# EAGLE design mega_board (EAGLE 6.2)
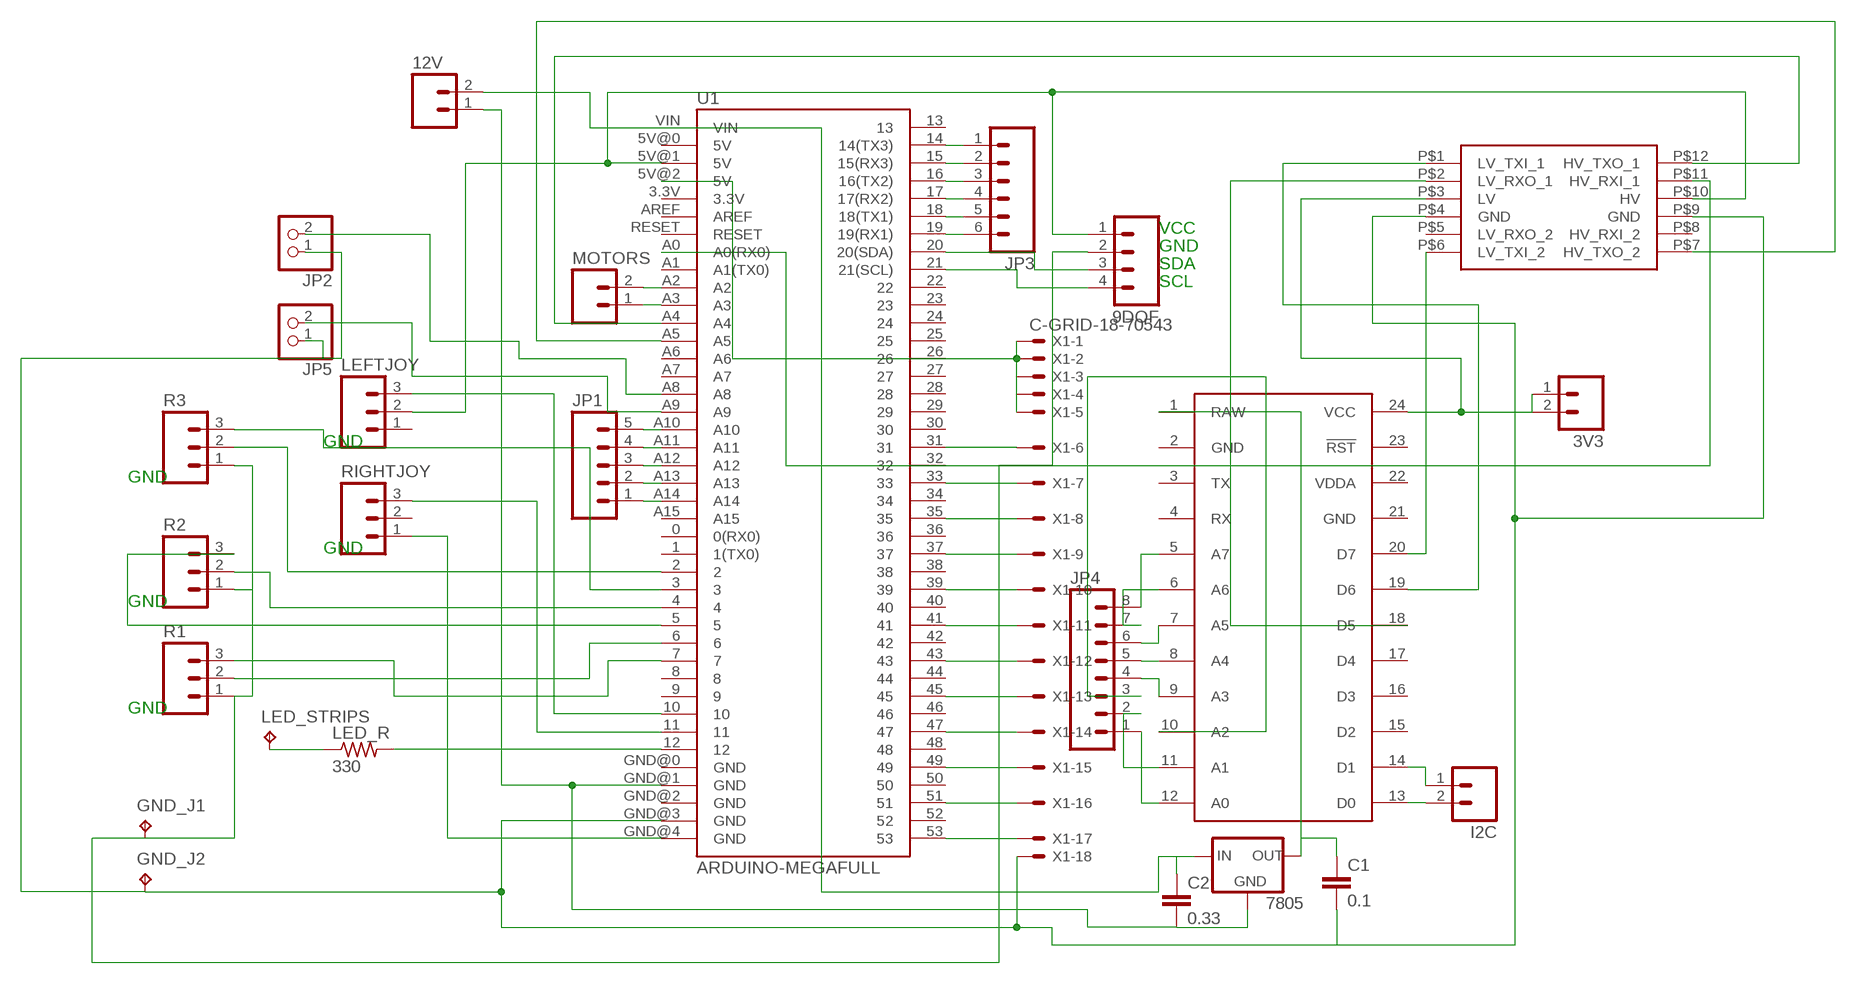
[diagram p0: schematic, sheet 1]

## Parts
3V3  M02PTH3  [1X02_LONGPADS]
9DOF  M04LONGPADS  [1X04_LONGPADS]
12V  M02PTH3  [1X02_LONGPADS]
7805  V_REG_78XXSIDE  [78XXL]
C1  0.1  C-EU050-024X044  [C050-024X044]
C2  0.33  C-EU050-024X044  [C050-024X044]
GND_J1  TPPAD1-17  [P1-17]
GND_J2  TPPAD1-17  [P1-17]
I2C  M02PTH3  [1X02_LONGPADS]
JP1  M05PTH_LONGPADS  [1X05_LONGPADS]
JP2  PINHD-1X2  [1X02]
JP3  M06LONGPADS  [1X06_LONGPADS]
JP4  M08LONGPADS  [1X08_LONGPADS]
JP5  PINHD-1X2  [1X02]
LED_R  330  R-US_0207/10  [0207/10]
LED_STRIPS  TPPAD1-17  [P1-17]
LEFTJOY  M03LONGPADS  [1X03_LONGPADS]
MOTORS  M02PTH3  [1X02_LONGPADS]
R1  M03LONGPADS  [1X03_LONGPADS]
R2  M03LONGPADS  [1X03_LONGPADS]
R3  M03LONGPADS  [1X03_LONGPADS]
RIGHTJOY  M03LONGPADS  [1X03_LONGPADS]
U1  ARDUINO-MEGAFULL  [ARDUINO_MEGA]
U$1  SPARK_CORECORE  [SPARK_CORE]
U$2  LOGIC_LEVEL_CONVERTER  [LOGIC_LEVEL_CONVERTER]
X1  C-GRID-18-70543  [70543-18]

## Nets
5V: 9DOF.1 LEFTJOY.2 U1.5V@1(5V) U$2.P$10(HV)
GND: C1.2 GND_J2.TP JP2.1 JP5.1 U1.GND@3(GND) U$2.P$4(GND) U$2.P$9(GND) X1.18
N$1: 9DOF.4 U1.21(21(SCL))
N$2: 9DOF.3 U1.20(20(SDA))
N$3: 3V3.1 3V3.2 U$1.24(VCC) U$2.P$3(LV)
N$4: RIGHTJOY.3 U1.11
N$5: U1.A4 U$2.P$12(HV_TXO_1)
N$6: U1.A5 U$2.P$7(HV_TXO_2)
N$7: U$1.20(D7) U$2.P$6(LV_TXI_2)
N$8: U$1.19(D6) U$2.P$1(LV_TXI_1)
N$9: LEFTJOY.3 U1.10
N$10: JP3.1 U1.14(14(TX3))
N$11: JP3.2 U1.15(15(RX3))
N$12: JP3.3 U1.16(16(TX2))
N$13: JP3.4 U1.17(17(RX2))
N$14: JP3.5 U1.18(18(TX1))
N$15: JP3.6 U1.19(19(RX1))
N$16: JP2.2 U1.A8
N$17: JP5.2 U1.A9
N$18: JP1.5 U1.A10
N$19: JP1.4 U1.A11
N$20: JP1.3 U1.A12
N$21: JP1.2 U1.A13
N$22: JP1.1 U1.A14
N$23: 12V.2 7805.IN C2.1 U1.VIN
N$24: 12V.1 7805.GND C2.2 U1.GND@1(GND)
N$25: JP4.8 U$1.5(A7)
N$26: JP4.7 U$1.6(A6)
N$27: JP4.6 U$1.7(A5)
N$28: JP4.5 U$1.8(A4)
N$29: JP4.4 U$1.9(A3)
N$30: JP4.1 U$1.12(A0)
N$31: JP4.2 U$1.11(A1)
N$32: JP4.3 U$1.10(A2)
N$33: I2C.2 U$1.13(D0)
N$34: I2C.1 U$1.14(D1)
N$35: 7805.OUT C1.1 U$1.1(RAW)
N$36: RIGHTJOY.1 U1.GND@4(GND)
N$37: MOTORS.2 U1.A2
N$38: MOTORS.1 U1.A3
N$39: LED_R.2 U1.12
N$40: LED_R.1 LED_STRIPS.TP
N$41: R3.3 U1.3
N$42: 9DOF.2 GND_J1.TP R1.1 R2.1 R3.1
N$43: R3.2 U1.2
N$44: R2.2 U1.4
N$45: R2.3 U1.5
N$46: R1.2 U1.6
N$47: R1.3 U1.7
N$48: U$1.18(D5) U$2.P$2(LV_RXO_1)
N$49: U1.A0(A0(RX0)) U$2.P$11(HV_RXI_1)
N$50: U1.51 X1.16
N$51: U1.53 X1.17
N$52: U1.31 X1.6
N$53: U1.47 X1.14
N$54: U1.33 X1.7
N$55: U1.35 X1.8
N$56: U1.37 X1.9
N$57: U1.39 X1.10
N$58: U1.41 X1.11
N$59: U1.43 X1.12
N$60: U1.45 X1.13
N$61: U1.49 X1.15
N$62: U1.5V@2(5V) X1.1 X1.2 X1.3 X1.4 X1.5
Unconnected: LEFTJOY.1 RIGHTJOY.2 U1.0(0(RX0)) U1.1(1(TX0)) U1.3.3V U1.5V@0(5V) U1.8 U1.9 U1.13 U1.22 U1.23 U1.24 U1.25 U1.26 U1.27 U1.28 U1.29 U1.30 U1.32 U1.34 U1.36 U1.38 U1.40 U1.42 U1.44 U1.46 U1.48 U1.50 U1.52 U1.A1(A1(TX0)) U1.A6 U1.A7 U1.A15 U1.AREF U1.GND@0(GND) U1.GND@2(GND) U1.RESET U$1.3(TX) U$1.4(RX) U$1.15(D2) U$1.16(D3) U$1.17(D4) U$1.23(!RST) U$2.P$5(LV_RXO_2) U$2.P$8(HV_RXI_2)

## Notes on the sheet
- VCC
- GND
- SDA
- SCL
- GND
- GND
- GND
- GND
- GND

## Power pins joined to a net without a drawn wire
GND: U$1.2(GND) U$1.21(GND)
VDDA: U$1.22(VDDA)

## Library data of the parts
3V3 12V I2C MOTORS = SparkFun:M02: Header 2 Standard 2-pin 0.1" header. Use with straight break away headers (SKU : PRT-00116), right angle break away headers (PRT-00553), swiss pins (PRT-00743), machine pins (PRT-00117), and female headers (PRT-00115). Molex polarized connector foot print use with SKU : PRT-08233 with associated crimp pins and housings.
9DOF = SparkFun:M04: Header 4 Standard 4-pin 0.1" header. Use with straight break away headers (SKU : PRT-00116), right angle break away headers (PRT-00553), swiss pins (PRT-00743), machine pins (PRT-00117), and female headers (PRT-00115). Molex polarized connector foot print use with SKU : PRT-08231 with associated crimp pins and housings.
7805 = SparkFun:V_REG_78XX: Voltage Regulator Standard 7805 5V regulator. IGO (Input Ground Output). Spark Fun Electronics SKU : COM-00107
C1 C2 = rcl:C-EU: CAPACITOR, European symbol
GND_J1 GND_J2 LED_STRIPS = testpad:TP: Test pad
JP1 = SparkFun:M05: Header 5 Standard 5-pin 0.1" header. Use with straight break away headers (SKU : PRT-00116), right angle break away headers (PRT-00553), swiss pins (PRT-00743), machine pins (PRT-00117), and female headers (PRT-00115). Molex polarized connector foot print use with SKU : PRT-08230 with associated crimp pins and housings.
JP2 JP5 = pinhead:PINHD-1X2: PIN HEADER
JP3 = SparkFun:M06: Header 6 Standard 6-pin 0.1" header. Use with straight break away headers (SKU : PRT-00116), right angle break away headers (PRT-00553), swiss pins (PRT-00743), machine pins (PRT-00117), and female headers (PRT-00115). Molex polarized connector foot print use with SKU : PRT-08094 with associated crimp pins and housings. NOTES ON THE VARIANTS LOCK and LOCK_LONGPADS... This footprint was designed to help hold the alignment of a through-hole component (i.e. 6-pin header) while soldering it into place. You may notice that each hole has been shifted either up or down by 0.005 of an inch from it's more standard position (which is a perfectly straight line). This slight alteration caused the pins (the squares in the middle) to touch the edges of the holes. Because they are alternating, it causes a "brace" to hold the component in place. 0.005 has proven to be the perfect amount of "off-center" position when using our standard breakaway headers. Although looks a little odd when you look at the bare footprint, once you have a header in there, the alteration is very hard to notice. Also, if you push a header all the way into place, it is covered up entirely on the bottom side. This idea of altering the position of holes to aid alignment will be further integrated into the Sparkfun Library for other footprints. It can help hold any component with 3 or more connection pins.
JP4 = SparkFun:M08: Header 8 Standard 8-pin 0.1" header. Use with straight break away headers (SKU : PRT-00116), right angle break away headers (PRT-00553), swiss pins (PRT-00743), machine pins (PRT-00117), and female headers (PRT-00115).
LED_R = resistor:R-US_: RESISTOR, American symbol
LEFTJOY R1-R3 RIGHTJOY = SparkFun:M03: Header 3 Standard 3-pin 0.1" header. Use with straight break away headers (SKU : PRT-00116), right angle break away headers (PRT-00553), swiss pins (PRT-00743), machine pins (PRT-00117), and female headers (PRT-00115). Molex polarized connector foot print use with SKU : PRT-08232 with associated crimp pins and housings.
U1 = SparkFun-Boards:ARDUINO-MEGA: Arduino Mega board footprint
U$1 = Spark:SPARK_CORE
U$2 = SparkFun-Boards:LOGIC_LEVEL_CONVERTER: Logic Level Converter (3.3v - 5v) https://www.sparkfun.com/products/8745
X1 = con-molex:C-GRID-18: CONNECTOR wire to board 2.54 mm (0.100") pitch header; OC_FARNELL: unknown; OC_NEWARK: unknown

## Board
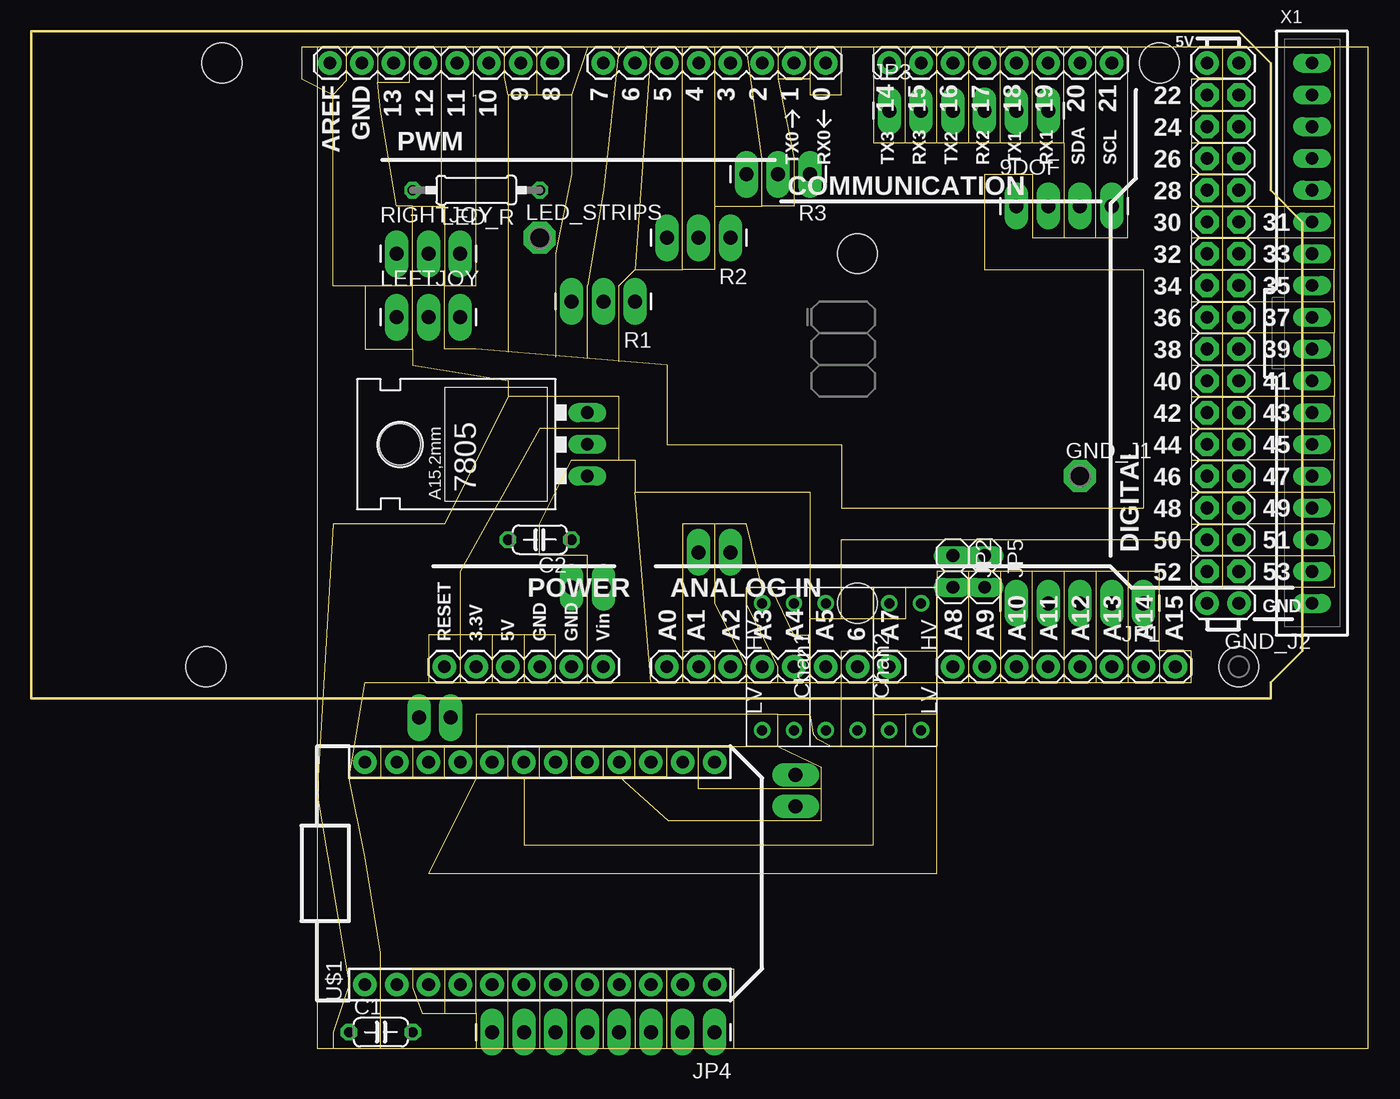
[diagram p1: board, top side]
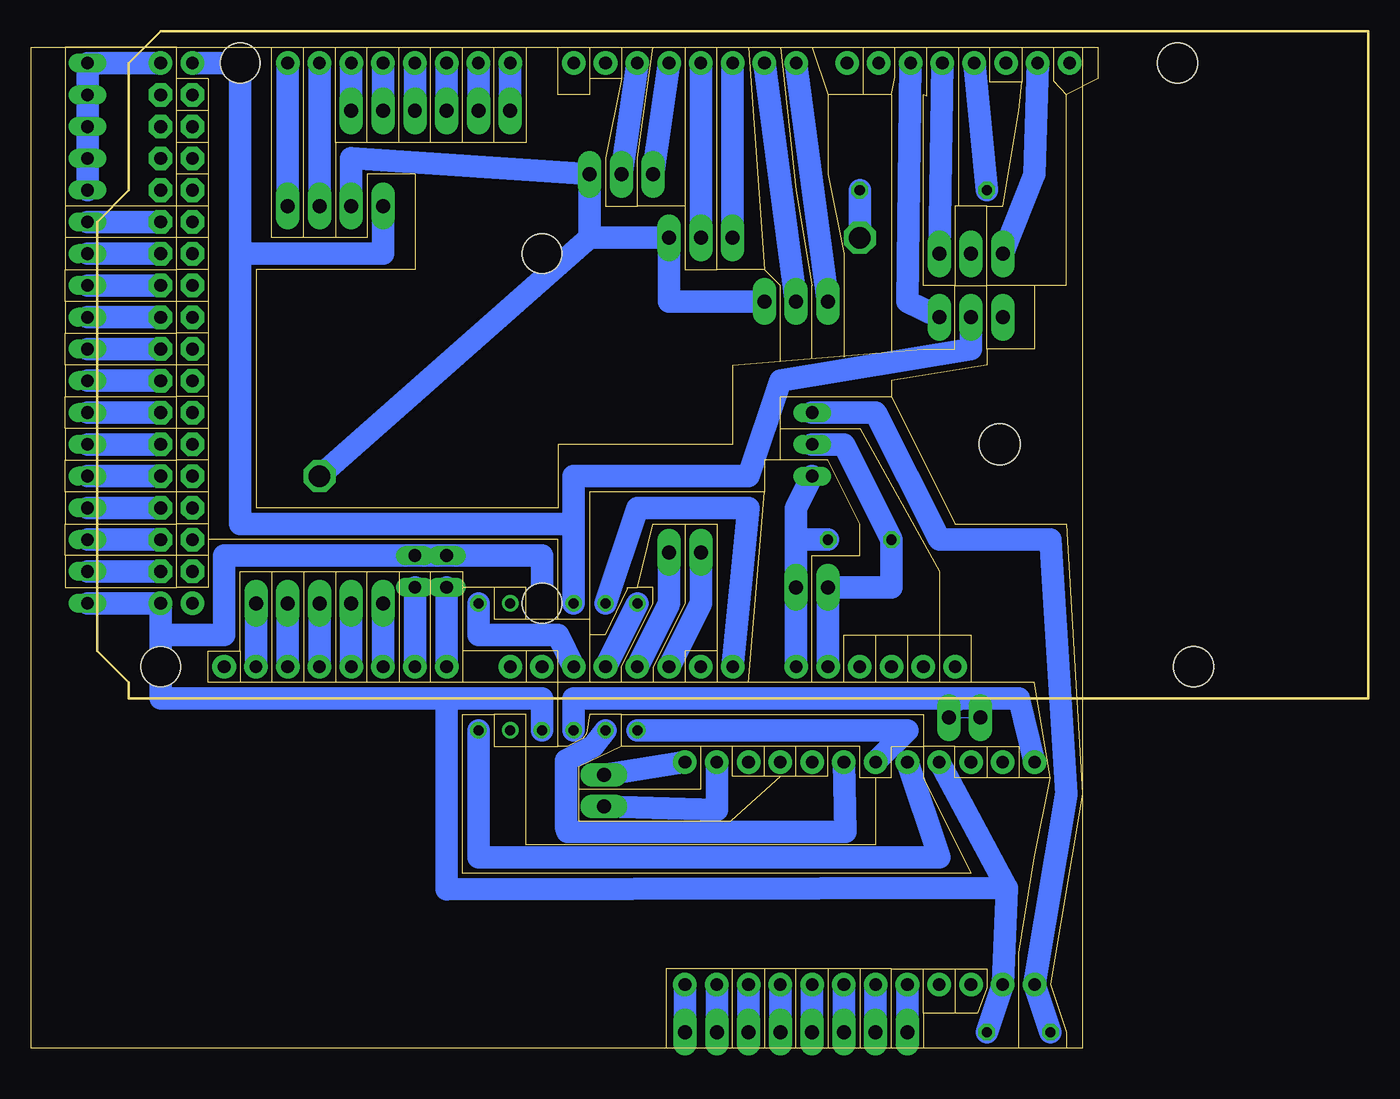
[diagram p2: board, bottom side, seen from below]

Size 84 x 80 mm. Coordinates in mm from the lower left corner, seen from the top.
Outline: 0,0 84,0 84,80 0,80 0,0
Copper layers (1*16): Top 0.035mm / dielectric 1.5mm / Bottom 0.035mm
Design rules: minimum track width 10mil, minimum drill 24mil, track to track 8mil, track to pad 8mil, pad to pad 8mil, via to via 8mil, smd to smd 8mil, copper to edge 40mil, drill to drill 8mil, minimum pad ring 10mil, minimum via ring 8mil, stop-mask expansion 4mil, vias tented up to drill 0mil, thermal gap 10mil
Milling: 394 lines

### Footprints (pad centres in the part's own frame; a part is rotated, then mirrored left to right if it is on the bottom)
1X02_LONGPADS = drill 1.118 pad 1.88 long: 1 0,0; 2 2.54,0
1X04_LONGPADS = drill 1.118 pad 1.88 long: 1 0,0; 2 2.54,0; 3 5.08,0; 4 7.62,0
78XXL = drill 1.016 long: GND 0,-3.81; IN -2.54,-3.81; OUT 2.54,-3.81 | hole 3.302: 0,11.176
C050-024X044 = drill 0.813 octagon: 1 -2.54,0; 2 2.54,0
P1-17 = drill 1.702 pad 2.54 octagon: TP 0,0
1X05_LONGPADS = drill 1.118 pad 1.88 long: 1 0,0; 2 2.54,0; 3 5.08,0; 4 7.62,0; 5 10.16,0
1X02 = drill 1.016 long: 1 -1.27,0; 2 1.27,0
1X06_LONGPADS = drill 1.118 pad 1.88 long: 1 0,0; 2 2.54,0; 3 5.08,0; 4 7.62,0; 5 10.16,0; 6 12.7,0
1X08_LONGPADS = drill 1.118 pad 1.88 long: 1 0,0; 2 2.54,0; 3 5.08,0; 4 7.62,0; 5 10.16,0; 6 12.7,0; 7 15.24,0; 8 17.78,0
0207/10 = drill 0.813 octagon: 1 -5.08,0; 2 5.08,0
1X03_LONGPADS = drill 1.118 pad 1.88 long: 1 0,0; 2 2.54,0; 3 5.08,0
ARDUINO_MEGA = drill 1.016 pad 1.88: 0 63.5,50.8; 1 60.96,50.8; 2 58.42,50.8; 3 55.88,50.8; 3.3V 35.56,2.54; 4 53.34,50.8; 5 50.8,50.8; 5V@0 38.1,2.54; 5V@1 93.98,50.8; 5V@2 96.52,50.8; 6 48.26,50.8; 7 45.72,50.8; 8 41.656,50.8; 9 39.116,50.8; 10 36.576,50.8; 11 34.036,50.8; 12 31.496,50.8; 13 28.956,50.8; 14 68.58,50.8; 15 71.12,50.8; 16 73.66,50.8; 17 76.2,50.8; 18 78.74,50.8; 19 81.28,50.8; 20 83.82,50.8; 21 86.36,50.8; A0 50.8,2.54; A1 53.34,2.54; A2 55.88,2.54; A3 58.42,2.54; A4 60.96,2.54; A5 63.5,2.54; A6 66.04,2.54; A7 68.58,2.54; A8 73.66,2.54; A9 76.2,2.54; A10 78.74,2.54; A11 81.28,2.54; A12 83.82,2.54; A13 86.36,2.54; A14 88.9,2.54; A15 91.44,2.54; AREF 23.876,50.8; GND@0 40.64,2.54; GND@1 43.18,2.54; GND@2 93.98,7.62; GND@3 96.52,7.62; GND@4 26.416,50.8; RESET 33.02,2.54; VIN 45.72,2.54 | drill 1.016 pad 1.88 octagon: 22 93.98,48.26; 23 96.52,48.26; 24 93.98,45.72; 25 96.52,45.72; 26 93.98,43.18; 27 96.52,43.18; 28 93.98,40.64; 29 96.52,40.64; 30 93.98,38.1; 31 96.52,38.1; 32 93.98,35.56; 33 96.52,35.56; 34 93.98,33.02; 35 96.52,33.02; 36 93.98,30.48; 37 96.52,30.48; 38 93.98,27.94; 39 96.52,27.94; 40 93.98,25.4; 41 96.52,25.4; 42 93.98,22.86; 43 96.52,22.86; 44 93.98,20.32; 45 96.52,20.32; 46 93.98,17.78; 47 96.52,17.78; 48 93.98,15.24; 49 96.52,15.24; 50 93.98,12.7; 51 96.52,12.7; 52 93.98,10.16; 53 96.52,10.16 | hole 3.2: 15.24,50.8; 13.97,2.54; 66.04,35.56; 66.04,7.62; 90.17,50.8; 96.52,2.54
SPARK_CORE = drill 1.016 pad 1.88: 1 -8.89,13.97; 2 -8.89,11.43; 3 -8.89,8.89; 4 -8.89,6.35; 5 -8.89,3.81; 6 -8.89,1.27; 7 -8.89,-1.27; 8 -8.89,-3.81; 9 -8.89,-6.35; 10 -8.89,-8.89; 11 -8.89,-11.43; 12 -8.89,-13.97; 13 8.89,-13.97; 14 8.89,-11.43; 15 8.89,-8.89; 16 8.89,-6.35; 17 8.89,-3.81; 18 8.89,-1.27; 19 8.89,1.27; 20 8.89,3.81; 21 8.89,6.35; 22 8.89,8.89; 23 8.89,11.43; 24 8.89,13.97
LOGIC_LEVEL_CONVERTER = drill 0.8: P$1 1.27,13.97; P$2 1.27,11.43; P$3 1.27,8.89; P$4 1.27,6.35; P$5 1.27,3.81; P$6 1.27,1.27; P$7 11.43,1.27; P$8 11.43,3.81; P$9 11.43,6.35; P$10 11.43,8.89; P$11 11.43,11.43; P$12 11.43,13.97
70543-18 = drill 1.016 long: 1 -21.59,0; 2 -19.05,0; 3 -16.51,0; 4 -13.97,0; 5 -11.43,0; 6 -8.89,0; 7 -6.35,0; 8 -3.81,0; 9 -1.27,0; 10 1.27,0; 11 3.81,0; 12 6.35,0; 13 8.89,0; 14 11.43,0; 15 13.97,0; 16 16.51,0; 17 19.05,0; 18 21.59,0

### Placement (x,y rotation side)
3V3  8.13,26.42 0 top
9DOF  55.88,67.31 0 top
12V  20.32,36.83 0 top
7805  17.78,48.26 90 top
C1  5.08,1.27 0 top
C2  17.78,40.64 180 top
GND_J1  60.96,45.72 0 top
GND_J2  73.66,30.48 0 top
I2C  38.23,19.3 90 top
JP1  66.04,35.56 180 top
JP2  50.8,38.1 270 top
JP3  45.72,74.93 0 top
JP4  31.75,1.27 180 top
JP5  53.34,38.1 270 top
LED_R  12.7,68.58 180 top
LED_STRIPS  17.78,64.77 0 top
LEFTJOY  6.35,58.42 0 top
MOTORS  33.02,39.62 180 top
R1  25.4,59.69 180 top
R2  33.02,64.77 180 top
R3  39.37,69.85 180 top
RIGHTJOY  6.35,63.5 0 top
U1  -22.86,27.94 0 top
U$1  17.78,13.97 90 top
U$2  49.53,24.13 90 top
X1  79.5,57.15 270 top

### Tracks (layer width: path | path; a pad name or v marks a point on that pad's centre or on a via)
5V
  Bottom 1.778: U1.5V@1 67.31,78.74 67.31,63.5 | 67.31,63.5 55.88,63.5 9DOF.1 | U$2.P$10 40.64,41.91 | 40.64,41.91 67.31,41.91 67.31,63.5 | LEFTJOY.2 8.89,55.88 24.13,53.34 26.67,45.72 40.64,45.72 40.64,41.91
GND
  Bottom 1.778: U$1.21 6.01,12.8 | 6.01,12.8 U$1.2 C1.2 | U$2.P$4 43.18,27.94 50.8,27.94 | 50.8,27.94 50.8,12.7 6.01,12.8 | 73.66,33.02 U1.GND@3 X1.18 | 73.66,33.02 GND_J2.TP 73.66,27.94 50.8,27.94 | U$2.P$9 43.18,39.37 JP2.1 JP5.1 68.58,39.37 68.58,33.02 73.66,33.02
N$1
  Bottom 1.778: U1.21 9DOF.4
N$2
  Bottom 1.778: 9DOF.3 U1.20
N$3
  Bottom 0.01: 3V3.1 3V3.2 8.13,27.94
  Bottom 1.778: U$1.24 5.08,27.94 8.13,27.94 40.64,27.94 U$2.P$3
N$4
  Bottom 1.778: U1.11 RIGHTJOY.3
N$5
  Bottom 1.778: U$2.P$12 U1.A4
N$6
  Bottom 1.778: U1.A5 41.91,33.02 48.26,33.02 U$2.P$7
N$7
  Bottom 1.778: U$1.20 11.43,15.24 48.26,15.24 U$2.P$6
N$8
  Bottom 1.778: U$2.P$1 13.97,25.4 U$1.19
N$9
  Bottom 1.778: U1.10 13.97,59.69 LEFTJOY.3
N$10
  Bottom 1.778: JP3.1 U1.14
N$11
  Bottom 1.778: JP3.2 U1.15
N$12
  Bottom 1.778: JP3.3 U1.16
N$13
  Bottom 1.778: JP3.4 U1.17
N$14
  Bottom 1.778: JP3.5 U1.18
N$15
  Bottom 1.778: JP3.6 U1.19
N$16
  Bottom 1.778: JP2.2 U1.A8
N$17
  Bottom 1.778: JP5.2 U1.A9
N$18
  Bottom 1.778: U1.A10 JP1.5
N$19
  Bottom 1.778: U1.A11 JP1.4
N$20
  Bottom 1.778: U1.A12 JP1.3
N$21
  Bottom 1.778: U1.A13 JP1.2
N$22
  Bottom 1.778: U1.A14 JP1.1
N$23
  Bottom 1.778: U1.VIN 12V.2 22.86,40.64 | 7805.IN 22.86,43.18 22.86,40.64 | C2.1 22.86,40.64
N$24
  Bottom 1.778: U1.GND@1 12V.1 15.24,36.83 C2.2 19.05,48.26 7805.GND
N$25
  Bottom 1.778: JP4.8 U$1.5
N$26
  Bottom 1.778: JP4.7 U$1.6
N$27
  Bottom 1.778: JP4.6 U$1.7
N$28
  Bottom 1.778: JP4.5 U$1.8
N$29
  Bottom 1.778: JP4.4 U$1.9
N$30
  Bottom 1.778: JP4.1 U$1.12
N$31
  Bottom 1.778: JP4.2 U$1.11
N$32
  Bottom 1.778: JP4.3 U$1.10
N$33
  Bottom 1.778: U$1.13 I2C.2
N$34
  Bottom 1.778: U$1.14 29.21,19.05 I2C.1
N$35
  Bottom 1.778: C1.1 U$1.1 1.27,20.32 2.54,40.64 11.43,40.64 16.51,50.8 7805.OUT
N$36
  Bottom 1.778: U1.GND@4 3.81,69.85 RIGHTJOY.1
N$37
  Bottom 1.778: U1.A2 30.48,35.56 MOTORS.2
N$38
  Bottom 1.778: U1.A3 33.02,35.56 MOTORS.1
N$39
  Bottom 1.778: U1.12 LED_R.2
N$40
  Bottom 1.778: LED_R.1 LED_STRIPS.TP
N$41
  Bottom 1.778: R3.3 U1.3
N$42
  Bottom 1.778: 9DOF.2 58.42,71.12 R3.1 39.37,64.77 | R1.1 33.02,59.69 R2.1 39.37,64.77 | GND_J1.TP 39.37,64.77
N$43
  Bottom 1.778: R3.2 U1.2
N$44
  Bottom 1.778: R2.2 U1.4
N$45
  Bottom 1.778: R2.3 U1.5
N$46
  Bottom 1.778: R1.2 U1.6
N$47
  Bottom 1.778: R1.3 U1.7
N$48
  Bottom 1.778: U$2.P$2 39.12,24.13 41.27,22.99 41.27,17.65 41.15,17.27 18.92,17.27 U$1.18
N$49
  Bottom 1.778: U$2.P$11 35.56,43.18 26.67,43.18 U1.A0
N$50
  Bottom 1.778: X1.16 U1.51
N$51
  Bottom 1.778: X1.17 U1.53
N$52
  Bottom 1.778: X1.6 U1.31
N$53
  Bottom 1.778: X1.14 U1.47
N$54
  Bottom 1.778: X1.7 U1.33
N$55
  Bottom 1.778: X1.8 U1.35
N$56
  Bottom 1.778: X1.9 U1.37
N$57
  Bottom 1.778: X1.10 U1.39
N$58
  Bottom 1.778: X1.11 U1.41
N$59
  Bottom 1.778: X1.12 U1.43
N$60
  Bottom 1.778: X1.13 U1.45
N$61
  Bottom 1.778: X1.15 U1.49
N$62
  Bottom 1.778: X1.5 X1.4 X1.3 X1.2 X1.1 U1.5V@2